# Altium schematic sheet 1_classyTKL_EC-plate.SchDoc: ClassyTKL - MX
size A4; Engineer: 4pplet; Address1: github.com/4pplet/classytkl; Address2: Licence: CERN-OHL-S; Revision: A3; SheetNumber: 1; SheetTotal: 3; ProjectName: waffling60
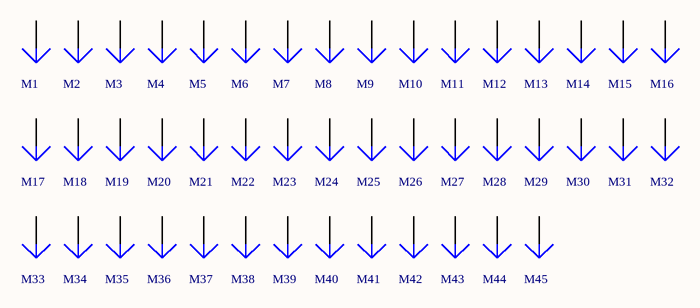
[diagram p0: 1_classyTKL_EC-plate.SchDoc]

## Parts
M1  Plug  [TH1620CTJ]  (value not drawn)
M2  Plug  [TH1620CTJ]  (value not drawn)
M3  Plug  [TH1620CTJ]  (value not drawn)
M4  Plug  [TH1620CTJ]  (value not drawn)
M5  Plug  [TH1620CTJ]  (value not drawn)
M6  Plug  [TH1620CTJ]  (value not drawn)
M7  Plug  [TH1620CTJ]  (value not drawn)
M8  Plug  [TH1620CTJ]  (value not drawn)
M9  Plug  [TH1620CTJ]  (value not drawn)
M10  Plug  [TH1620CTJ]  (value not drawn)
M11  Plug  [TH1620CTJ]  (value not drawn)
M12  Plug  [TH1620CTJ]  (value not drawn)
M13  Plug  [TH1620CTJ]  (value not drawn)
M14  Plug  [TH1620CTJ]  (value not drawn)
M15  Plug  [TH1620CTJ]  (value not drawn)
M16  Plug  [TH1620CTJ]  (value not drawn)
M17  Plug  [TH1620CTJ]  (value not drawn)
M18  Plug  [TH1620CTJ]  (value not drawn)
M19  Plug  [TH1620CTJ]  (value not drawn)
M20  Plug  [TH1620CTJ]  (value not drawn)
M21  Plug  [TH1620CTJ]  (value not drawn)
M22  Plug  [TH1620CTJ]  (value not drawn)
M23  Plug  [TH1620CTJ]  (value not drawn)
M24  Plug  [TH1620CTJ]  (value not drawn)
M25  Plug  [TH1620CTJ]  (value not drawn)
M26  Plug  [TH1620CTJ]  (value not drawn)
M27  Plug  [TH1620CTJ]  (value not drawn)
M28  Plug  [TH1620CTJ]  (value not drawn)
M29  Plug  [TH1620CTJ]  (value not drawn)
M30  Plug  [TH1620CTJ]  (value not drawn)
M31  Plug  [TH1620CTJ]  (value not drawn)
M32  Plug  [TH1620CTJ]  (value not drawn)
M33  Plug  [TH1620CTJ]  (value not drawn)
M34  Plug  [TH1620CTJ]  (value not drawn)
M35  Plug  [TH1620CTJ]  (value not drawn)
M36  Plug  [TH1620CTJ]  (value not drawn)
M37  Plug  [TH1620CTJ]  (value not drawn)
M38  Plug  [TH1620CTJ]  (value not drawn)
M39  Plug  [TH1620CTJ]  (value not drawn)
M40  Plug  [TH1620CTJ]  (value not drawn)
M41  Plug  [TH1620CTJ]  (value not drawn)
M42  Plug  [TH1620CTJ]  (value not drawn)
M43  Plug  [TH1620CTJ]  (value not drawn)
M44  Plug  [TH1620CTJ]  (value not drawn)
M45  Plug  [TH1620CTJ]  (value not drawn)

## Nets

Not connected (* = marked no-connect by the designer): M1 1; M2 1; M3 1; M4 1; M5 1; M6 1; M7 1; M8 1; M9 1; M10 1; M11 1; M12 1; M13 1; M14 1; M15 1; M16 1; M17 1; M18 1; M19 1; M20 1; M21 1; M22 1; M23 1; M24 1; M25 1; M26 1; M27 1; M28 1; M29 1; M30 1; M31 1; M32 1; M33 1; M34 1; M35 1; M36 1; M37 1; M38 1; M39 1; M40 1; M41 1; M42 1; M43 1; M44 1; M45 1

## Notes on the sheet
- Title
- Size:
- Date:
- A4
- Number:
- Time:
- Revision:
- Sheet
- of
- File:

## Library data of the parts
M1-M45 = Plug: LCSC MFG: Sinhoo; LCSC Part #: C3020123; MRF.Part: TH1620CTJ